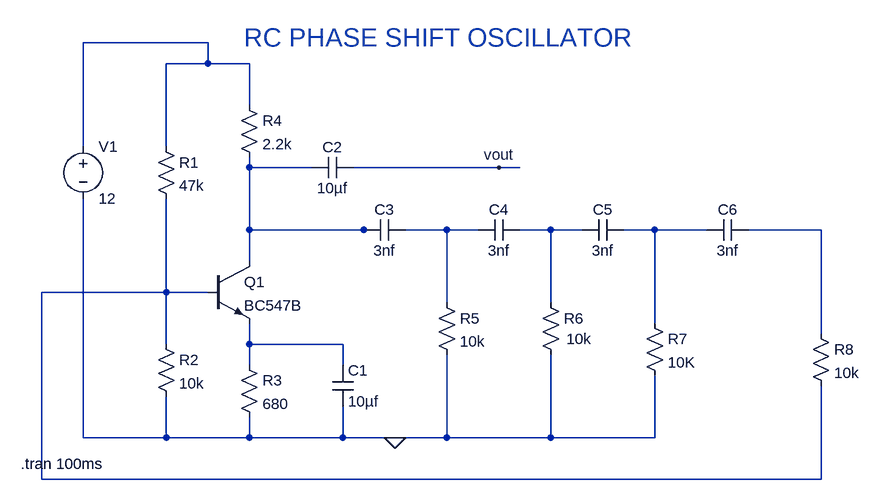
[diagram p0: schematic phaseOscltr2.asc]
phaseOscltr2.asc, the LTspice schematic file:
Version 4
SHEET 1 980 680
WIRE -32 -192 -224 -192
WIRE -32 -160 -32 -192
WIRE -32 -160 -96 -160
WIRE 32 -160 -32 -160
WIRE 32 -96 32 -160
WIRE -224 -32 -224 -192
WIRE -96 -32 -96 -160
WIRE 32 0 32 -16
WIRE 128 0 32 0
WIRE 416 0 192 0
WIRE 448 0 416 0
WIRE 32 96 32 0
WIRE 208 96 32 96
WIRE 224 96 208 96
WIRE 336 96 272 96
WIRE 384 96 336 96
WIRE 496 96 448 96
WIRE 544 96 496 96
WIRE 656 96 608 96
WIRE 736 96 656 96
WIRE 912 96 800 96
WIRE 32 144 32 96
WIRE -96 192 -96 48
WIRE -96 192 -288 192
WIRE -32 192 -96 192
WIRE 336 208 336 96
WIRE 496 208 496 96
WIRE 656 240 656 96
WIRE 912 256 912 96
WIRE -96 272 -96 192
WIRE 32 272 32 240
WIRE 176 272 32 272
WIRE 32 304 32 272
WIRE 176 304 176 272
WIRE -224 416 -224 48
WIRE -96 416 -96 352
WIRE -96 416 -224 416
WIRE 32 416 32 384
WIRE 32 416 -96 416
WIRE 176 416 176 368
WIRE 176 416 32 416
WIRE 256 416 176 416
WIRE 336 416 336 288
WIRE 336 416 256 416
WIRE 496 416 496 288
WIRE 496 416 336 416
WIRE 656 416 656 320
WIRE 656 416 496 416
WIRE -288 480 -288 192
WIRE 912 480 912 336
WIRE 912 480 -288 480
FLAG 416 0 vout
FLAG 256 416 0
SYMBOL res -112 -48 R0
SYMATTR InstName R1
SYMATTR Value 47k
SYMBOL res -112 256 R0
SYMATTR InstName R2
SYMATTR Value 10k
SYMBOL res 16 288 R0
SYMATTR InstName R3
SYMATTR Value 680
SYMBOL cap 160 304 R0
SYMATTR InstName C1
SYMATTR Value 10µf
SYMBOL cap 192 -16 R90
WINDOW 0 0 32 VBottom 2
WINDOW 3 32 32 VTop 2
SYMATTR InstName C2
SYMATTR Value 10µf
SYMBOL cap 272 80 R90
WINDOW 0 0 32 VBottom 2
WINDOW 3 32 32 VTop 2
SYMATTR InstName C3
SYMATTR Value 3nf
SYMBOL cap 448 80 R90
WINDOW 0 0 32 VBottom 2
WINDOW 3 32 32 VTop 2
SYMATTR InstName C4
SYMATTR Value 3nf
SYMBOL cap 608 80 R90
WINDOW 0 0 32 VBottom 2
WINDOW 3 32 32 VTop 2
SYMATTR InstName C5
SYMATTR Value 3nf
SYMBOL res 16 -112 R0
SYMATTR InstName R4
SYMATTR Value 2.2k
SYMBOL res 320 192 R0
SYMATTR InstName R5
SYMATTR Value 10k
SYMBOL res 480 192 R0
WINDOW 3 40 72 Left 2
SYMATTR Value 10k
SYMATTR InstName R6
SYMBOL npn -32 144 R0
SYMATTR InstName Q1
SYMATTR Value BC547B
SYMBOL res 640 224 R0
SYMATTR InstName R7
SYMATTR Value 10K
SYMBOL voltage -224 -48 R0
WINDOW 123 0 0 Left 0
WINDOW 39 0 0 Left 0
SYMATTR InstName V1
SYMATTR Value 12
SYMBOL cap 800 80 R90
WINDOW 0 0 32 VBottom 2
WINDOW 3 32 32 VTop 2
SYMATTR InstName C6
SYMATTR Value 3nf
SYMBOL res 896 240 R0
SYMATTR InstName R8
SYMATTR Value 10k
TEXT -320 456 Left 2 !.tran 100ms
TEXT 24 -200 Left 4 ;RC PHASE SHIFT OSCILLATOR

The netlist it stands for:
* phaseOscltr2.asc
R1 N001 N007 47k
R2 N007 0 10k
R3 N008 0 680
C1 N008 0 10µf
C2 vout N002 10µf
C3 N003 N002 3nf
C4 N004 N003 3nf
C5 N005 N004 3nf
R4 N001 N002 2.2k
R5 N003 0 10k
R6 N004 0 10k
Q1 N002 N007 N008 0 BC547B
R7 N005 0 10K
V1 N001 0 12
C6 N006 N005 3nf
R8 N006 N007 10k
.model NPN NPN
.model PNP PNP
.lib standard.bjt
.tran 100ms
* RC PHASE SHIFT OSCILLATOR
.backanno
.end